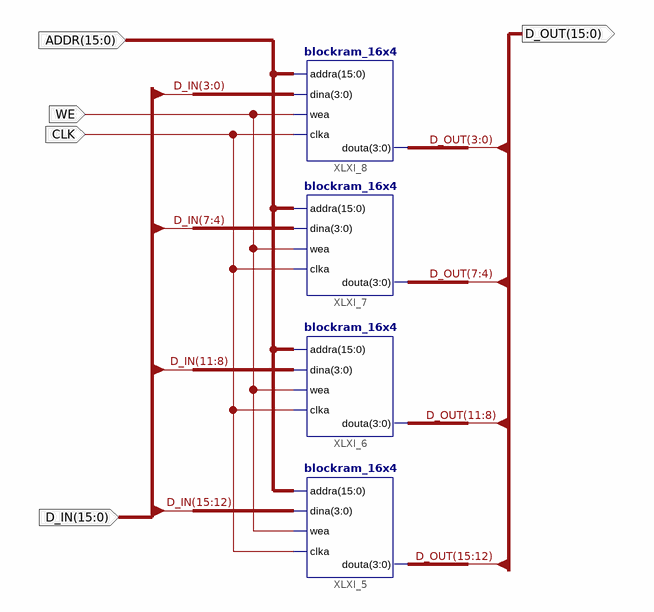
[diagram p0: schematic sheet 1]
// Xilinx ISE schematic ram_16x16.sch (spartan3e) as structural Verilog: 4 symbols, 5 ports
module ram_16x16 (
  input  [15:0] ADDR,
  input  WE,
  input  CLK,
  input  [15:0] D_IN,
  output [15:0] D_OUT
);

  blockram_16x4 XLXI_5 (.addra(ADDR), .dina(D_IN[15:12]), .wea(WE), .clka(CLK), .douta(D_OUT[15:12]));
  blockram_16x4 XLXI_6 (.addra(ADDR), .dina(D_IN[11:8]), .wea(WE), .clka(CLK), .douta(D_OUT[11:8]));
  blockram_16x4 XLXI_7 (.addra(ADDR), .dina(D_IN[7:4]), .wea(WE), .clka(CLK), .douta(D_OUT[7:4]));
  blockram_16x4 XLXI_8 (.addra(ADDR), .dina(D_IN[3:0]), .wea(WE), .clka(CLK), .douta(D_OUT[3:0]));
endmodule
